# EAGLE design PowerBoard (EAGLE 9.2.2)

## Sheet 1 of 3
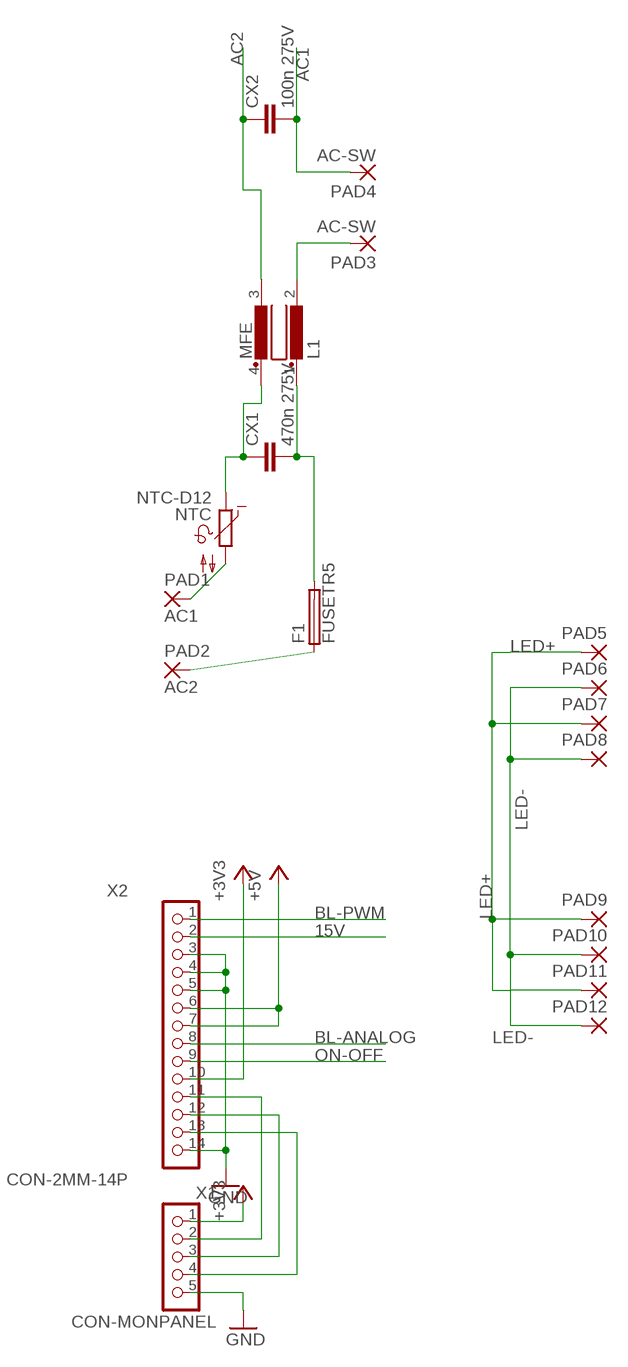
[diagram p0: schematic, sheet 1]

### Parts
CX1  470n 275V  CXXC15B10  [XC15B10]
CX2  100n 275V  CXXC15B6  [XC15B6]
F1  FUSETR5  [TR5]
L1  MFE  [MFE]
NTC  NTC-D12  [NTC-D12]
PAD1  AC1  WIREPAD3,81/1,4  [3,81/1,4]
PAD2  AC2  WIREPAD3,81/1,4  [3,81/1,4]
PAD3  AC-SW  WIREPAD2,54/1,1  [2,54/1,1]
PAD4  AC-SW  WIREPAD2,54/1,1  [2,54/1,1]
PAD5  2,54/1,1  [2,54/1,1]
PAD6  2,54/1,1  [2,54/1,1]
PAD7  2,54/1,1  [2,54/1,1]
PAD8  2,54/1,1  [2,54/1,1]
PAD9  2,54/1,1  [2,54/1,1]
PAD10  2,54/1,1  [2,54/1,1]
PAD11  2,54/1,1  [2,54/1,1]
PAD12  2,54/1,1  [2,54/1,1]
X1  CON-MONPANEL  [CON-5-PANEL]
X2  CON-2MM-14P  [CON-14-2MM]

### Nets
15V: X2.2
+3V3: X1.1 X2.10
+5V: X2.6 X2.7 ; also sheet 3
AC1: CX2.2 PAD4.1(P) ; also sheet 2,3
AC2: CX2.1 L1.3 ; also sheet 2,3
BL-ANALOG: X2.8
BL-PWM: X2.1 ; also sheet 2
GND: X1.5 X2.3 X2.4 X2.5 X2.14 ; also sheet 2,3
LED+: PAD5.1(P) PAD7.1(P) PAD9.1(P) PAD11.1(P) ; also sheet 2
LED-: PAD6.1(P) PAD8.1(P) PAD10.1(P) PAD12.1(P) ; also sheet 2
N$1: X1.2 X2.11
N$2: X1.3 X2.12
N$3: X1.4 X2.13
N$12: NTC.2 PAD1.1(P)
N$20: F1.1 PAD2.1(P)
N$35: CX1.1 L1.4 NTC.1
N$36: CX1.2 F1.2 L1.1
N$38: L1.2 PAD3.1(P)
ON-OFF: X2.9 ; also sheet 2

## Sheet 2 of 3
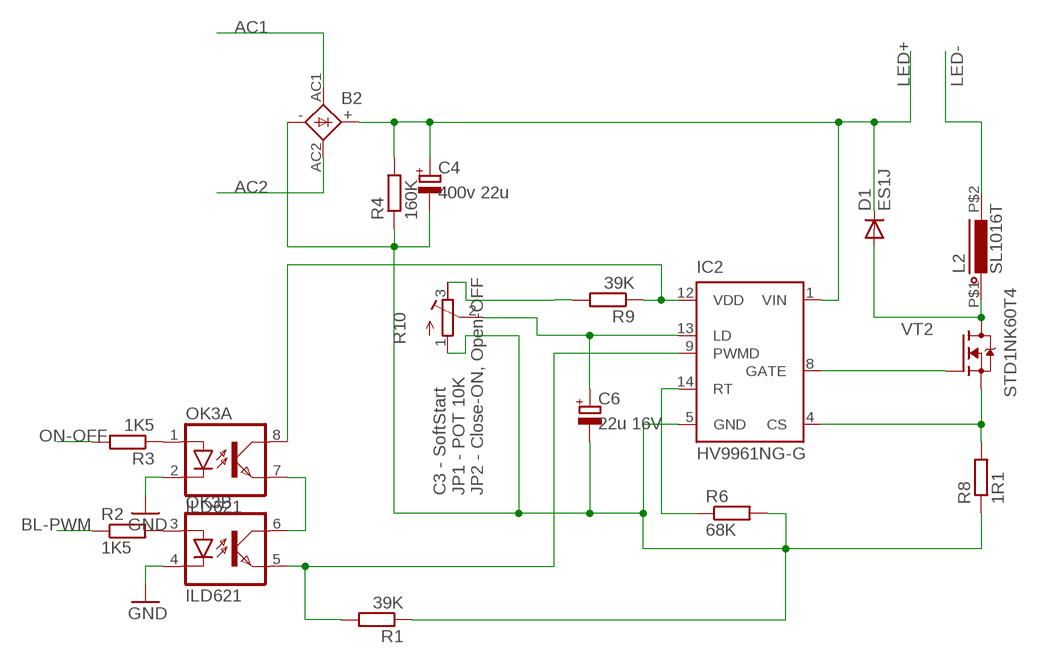
[diagram p1: schematic, sheet 2]

### Parts
B2  BRIDGEDBS  [DBS]
C4  400v 22u  CAP-POL_E3.5-8  [E3,5-8]
C6  22u 16V  CAP-POL_3528  [CT3528]
D1  ES1J  DIODE_ES1J  [DO214AC]
IC2  HV9961NG-G  HV9910BNG  [SOIC-16NG]
L2  SL1016T  INDUCTORSL1016  [SL1016]
OK3  ILD621  [DIL08]
R1  39K  R_R0805  [RESC2012X50]
R2  1K5  R_MF-025  [MF-025]
R3  1K5  R_MF-025  [MF-025]
R4  160K  R_MF-0125  [MF-0125]
R6  68K  R_R0805  [RESC2012X50]
R8  1R1  R_MF-05  [MF-05]
R9  39K  R_R0805  [RESC2012X50]
R10  R_POT3296X  [POT-3296X]
VT2  STD1NK60T4  FET-NDPAK  [DPAK]

### Nets
AC1: B2.AC1 ; also sheet 1,3
AC2: B2.AC2 ; also sheet 1,3
BL-PWM: R2.1 ; also sheet 1
GND: OK3.2(A:C) OK3.4(B:C) ; also sheet 1,3
LED+: B2.+ C4.+ D1.C IC2.1(VIN) R4.2 ; also sheet 1
LED-: L2.P$2 ; also sheet 1
N$6: OK3.6(B:COL) OK3.7(A:EMIT)
N$7: IC2.9(PWMD) OK3.5(B:EMIT) R1.2
N$8: OK3.1(A:A) R3.1
N$9: OK3.3(B:A) R2.2
N$10: IC2.14(RT) R6.1
N$11: IC2.8(GATE) VT2.G
N$18: D1.A L2.P$1 VT2.D
N$24: IC2.4(CS) R8.2 VT2.S
N$25: B2.- C4.- C6.- IC2.5(GND) R1.1 R4.1 R6.2 R8.1 R10.1(A)
N$26: C6.+ IC2.13(LD) R10.2(S)
N$27: R9.2 R10.3(E)
N$29: IC2.12(VDD) OK3.8(A:COL) R9.1
ON-OFF: R3.2 ; also sheet 1

### Notes on the sheet
- C3 - SoftStart
  JP1 - POT 10K
  JP2 - Close-ON, Open-OFF

## Sheet 3 of 3
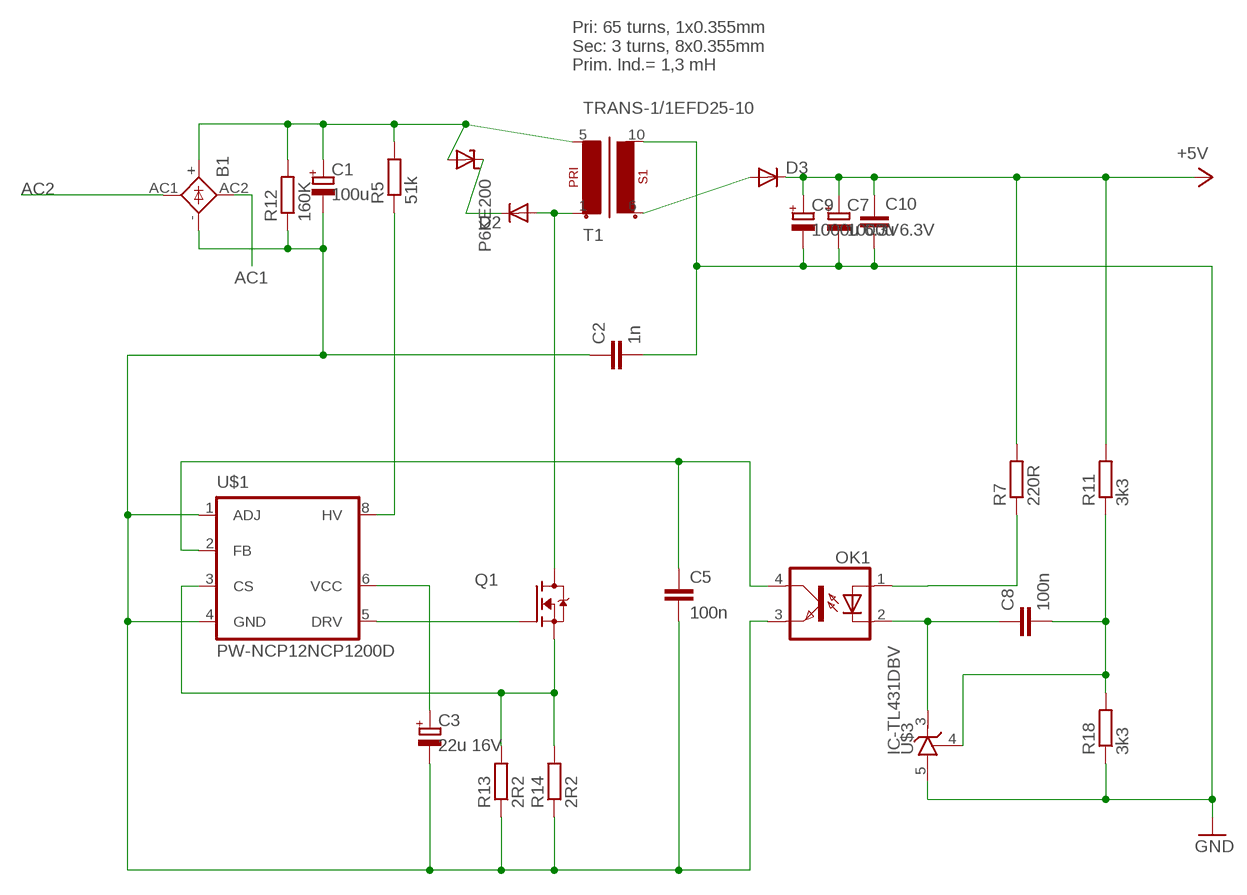
[diagram p2: schematic, sheet 3]

### Parts
B1  KBL  [KBL]
C1  100u  CAP-POL_E5-13-35-H  [E5-13-35-HORIZ]
C2  1n  CAP_C50-024X044  [C050-024X044]
C3  22u 16V  CAP-POL_E2.5-7  [E2,5-7]
C5  100n  CAP_1206  [CAP1206]
C7  1000u 6.3V  CAP-POL_E3.5-8  [E3,5-8]
C8  100n  CAP_1206  [CAP1206]
C9  1000u 6.3V  CAP-POL_E3.5-8  [E3,5-8]
C10  CAP_0805  [CAP0805]
D2  DIODE_ES1J  [DO214AC]
D3  DIODE_TO-220-2  [TO220ACS]
OK1  OPTOTRANSPC817  [DIL04]
P6KE200  SUPRESSORDO-204AC  [DO15-12]
Q1  FET-NTO-220  [TO-220V]
R5  51k  R_SQP-5  [SQP-5]
R7  220R  R_R1206  [RESC3216X60]
R11  3k3  R_R1206  [RESC3216X60]
R12  160K  R_MF-0125  [MF-0125]
R13  2R2  R_MF-025  [MF-025]
R14  2R2  R_MF-025  [MF-025]
R18  3k3  R_R1206  [RESC3216X60]
T1  TRANS-1/1EFD25-10  [EFD25_10PIN]
U$1  PW-NCP12NCP1200D  [SO8]
U$3  IC-TL431DBV  [SOT95P280X145-5]

### Nets
+5V: C7.+ C9.+ C10.1 D3.C R7.2 R11.2 ; also sheet 1
AC1: B1.AC2(AC1) ; also sheet 1,2
AC2: B1.AC1(AC2) ; also sheet 1,2
GND: C2.2 C7.- C9.- C10.2 R18.1 T1.10(S1-2) U$3.5(A) ; also sheet 1,2
N$13: B1.+ C1.+ P6KE200.A R5.2 R12.2 T1.5(P1-2)
N$14: D2.A Q1.2(D) T1.1(P1-1)
N$15: R5.1 U$1.8(HV)
N$16: C3.+ U$1.6(VCC)
N$17: C5.1 OK1.4(COL) U$1.2(FB)
N$19: D2.C P6KE200.C
N$21: OK1.1(A) R7.1
N$22: Q1.1(G) U$1.5(DRV)
N$23: C8.2 R11.1 R18.2 U$3.4(R)
N$30: B1.- C1.- C2.1 C3.- C5.2 OK1.3(EMIT) R12.1 R13.1 R14.1 U$1.1(ADJ) U$1.4(GND)
N$31: C8.1 OK1.2(C) U$3.3(C)
N$33: Q1.3(S) R13.2 R14.2 U$1.3(CS)
N$41: D3.A T1.6(S1-1)

### Notes on the sheet
- Pri: 65 turns, 1x0.355mm
  Sec: 3 turns, 8x0.355mm
  Prim. Ind.= 1,3 mH

## Library data of the parts
B1 = rectifier:KBL: DIOTEC RECTIFIER
B2 = Flamberm:BRIDGE: GENERAL INSTRUMENT RECTIFIER
C1 C7 C9 = Flamberm:CAP-POL_
C2 = Namenlos:CAP_
C3 C4 C6 = Namenlos:CAP-POL_
C5 C8 C10 = Flamberm:CAP_
CX1 CX2 = rcl:CX: X CAPACITOR for power line; SPICEPREFIX: C
D1-D3 = Flamberm:DIODE_
F1 = fuse:FUSE: Fuse; OC_FARNELL: unknown; OC_NEWARK: unknown
IC2 = Flamberm:HV9910B: Universal High Brightness LED Driver Source: www.supertex.com .. led_driver_ics_SG.pdf; OC_FARNELL: unknown; OC_NEWARK: unknown
L1 = inductors:MFE: FILTER
L2 = Namenlos:INDUCTOR
NTC = Namenlos:NTC-D12
OK1 = Namenlos:OPTOTRANS: SHARP OPTO COUPLER; MPN: PC817X4J000F; OC_FARNELL: 9707727; OC_NEWARK: 97K7059
OK3 = optocoupler:ILD621: SIEMENS OPTO COUPLER; MF: VISHAY/TELEFUNKEN; MPN: ILD621; OC_FARNELL: 1020151; OC_NEWARK: 58K1678
P6KE200 = Flamberm:SUPRESSOR
PAD1-PAD4 = wirepad:WIREPAD: Wire PAD connect wire on PCB
PAD5-PAD12 = wirepad:2,54/1,1: THROUGH-HOLE PAD
Q1 VT2 = Namenlos:FET-N
R1-R9 R11 R13 R14 R18 = Flamberm:R_
R10 = Flamberm:R_POT
R12 = Namenlos:R_
T1 = Flamberm:TRANS-1/1
U$1 = Namenlos:PW-NCP12*
U$3 = Flamberm:IC-TL431
X1 = Flamberm:CON-MONPANEL
X2 = Flamberm:CON-2MM-14P

## Board
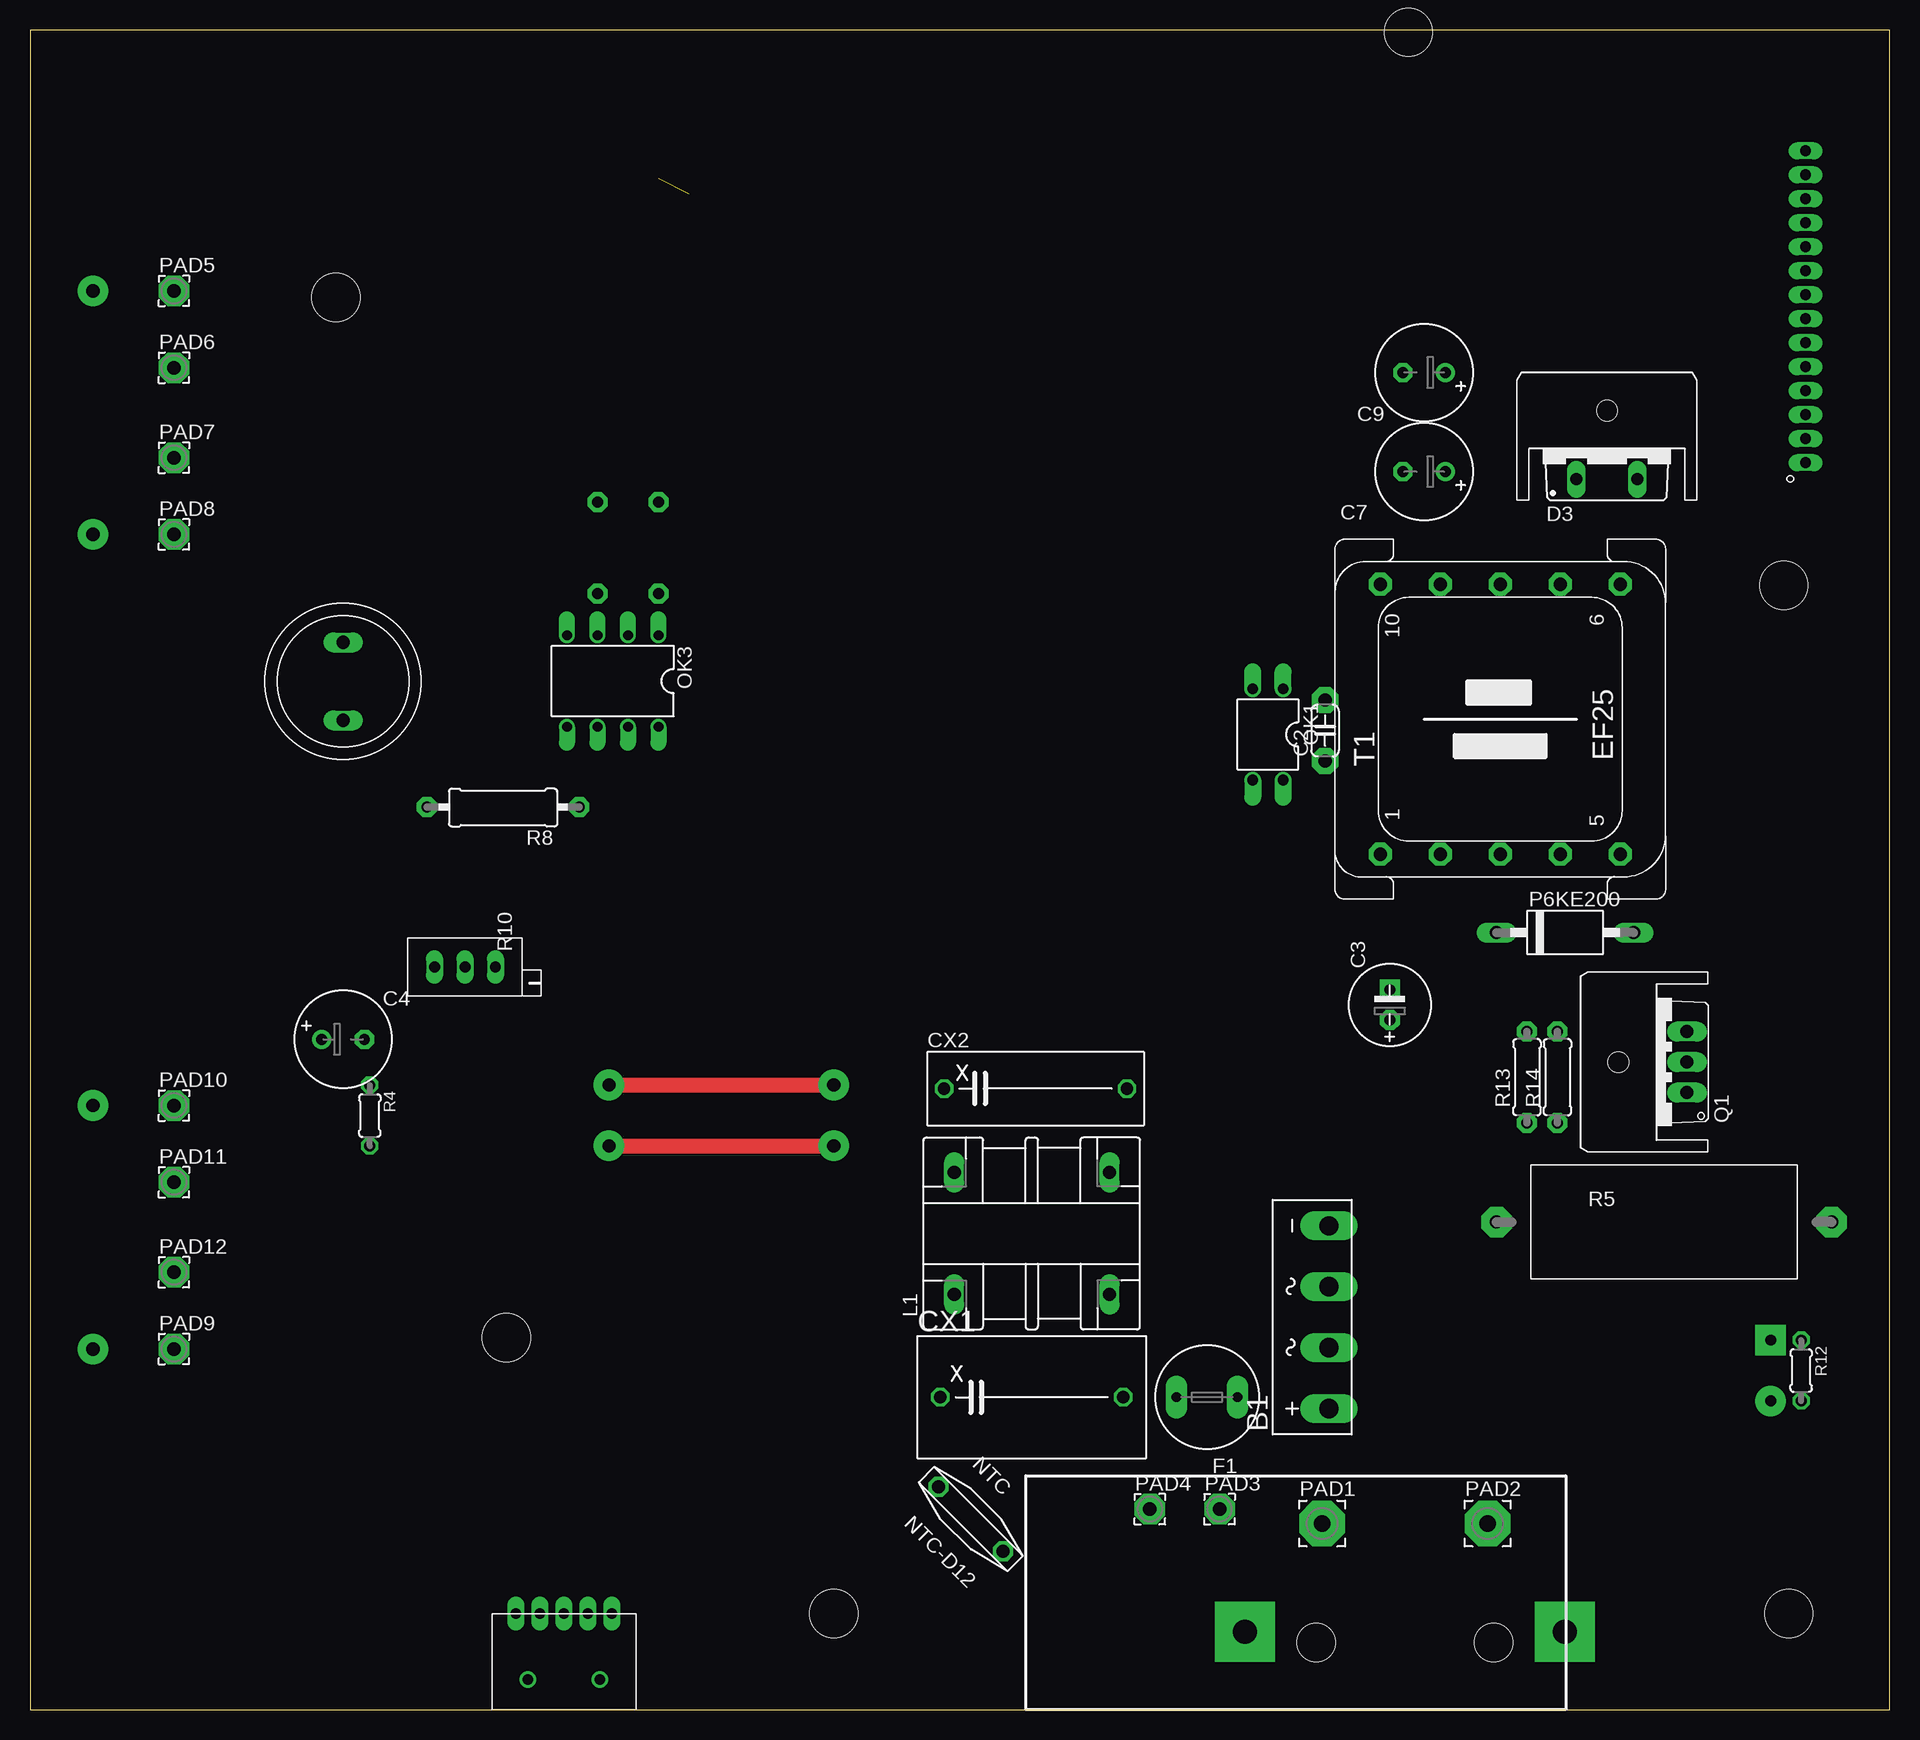
[diagram p3: board, top side]
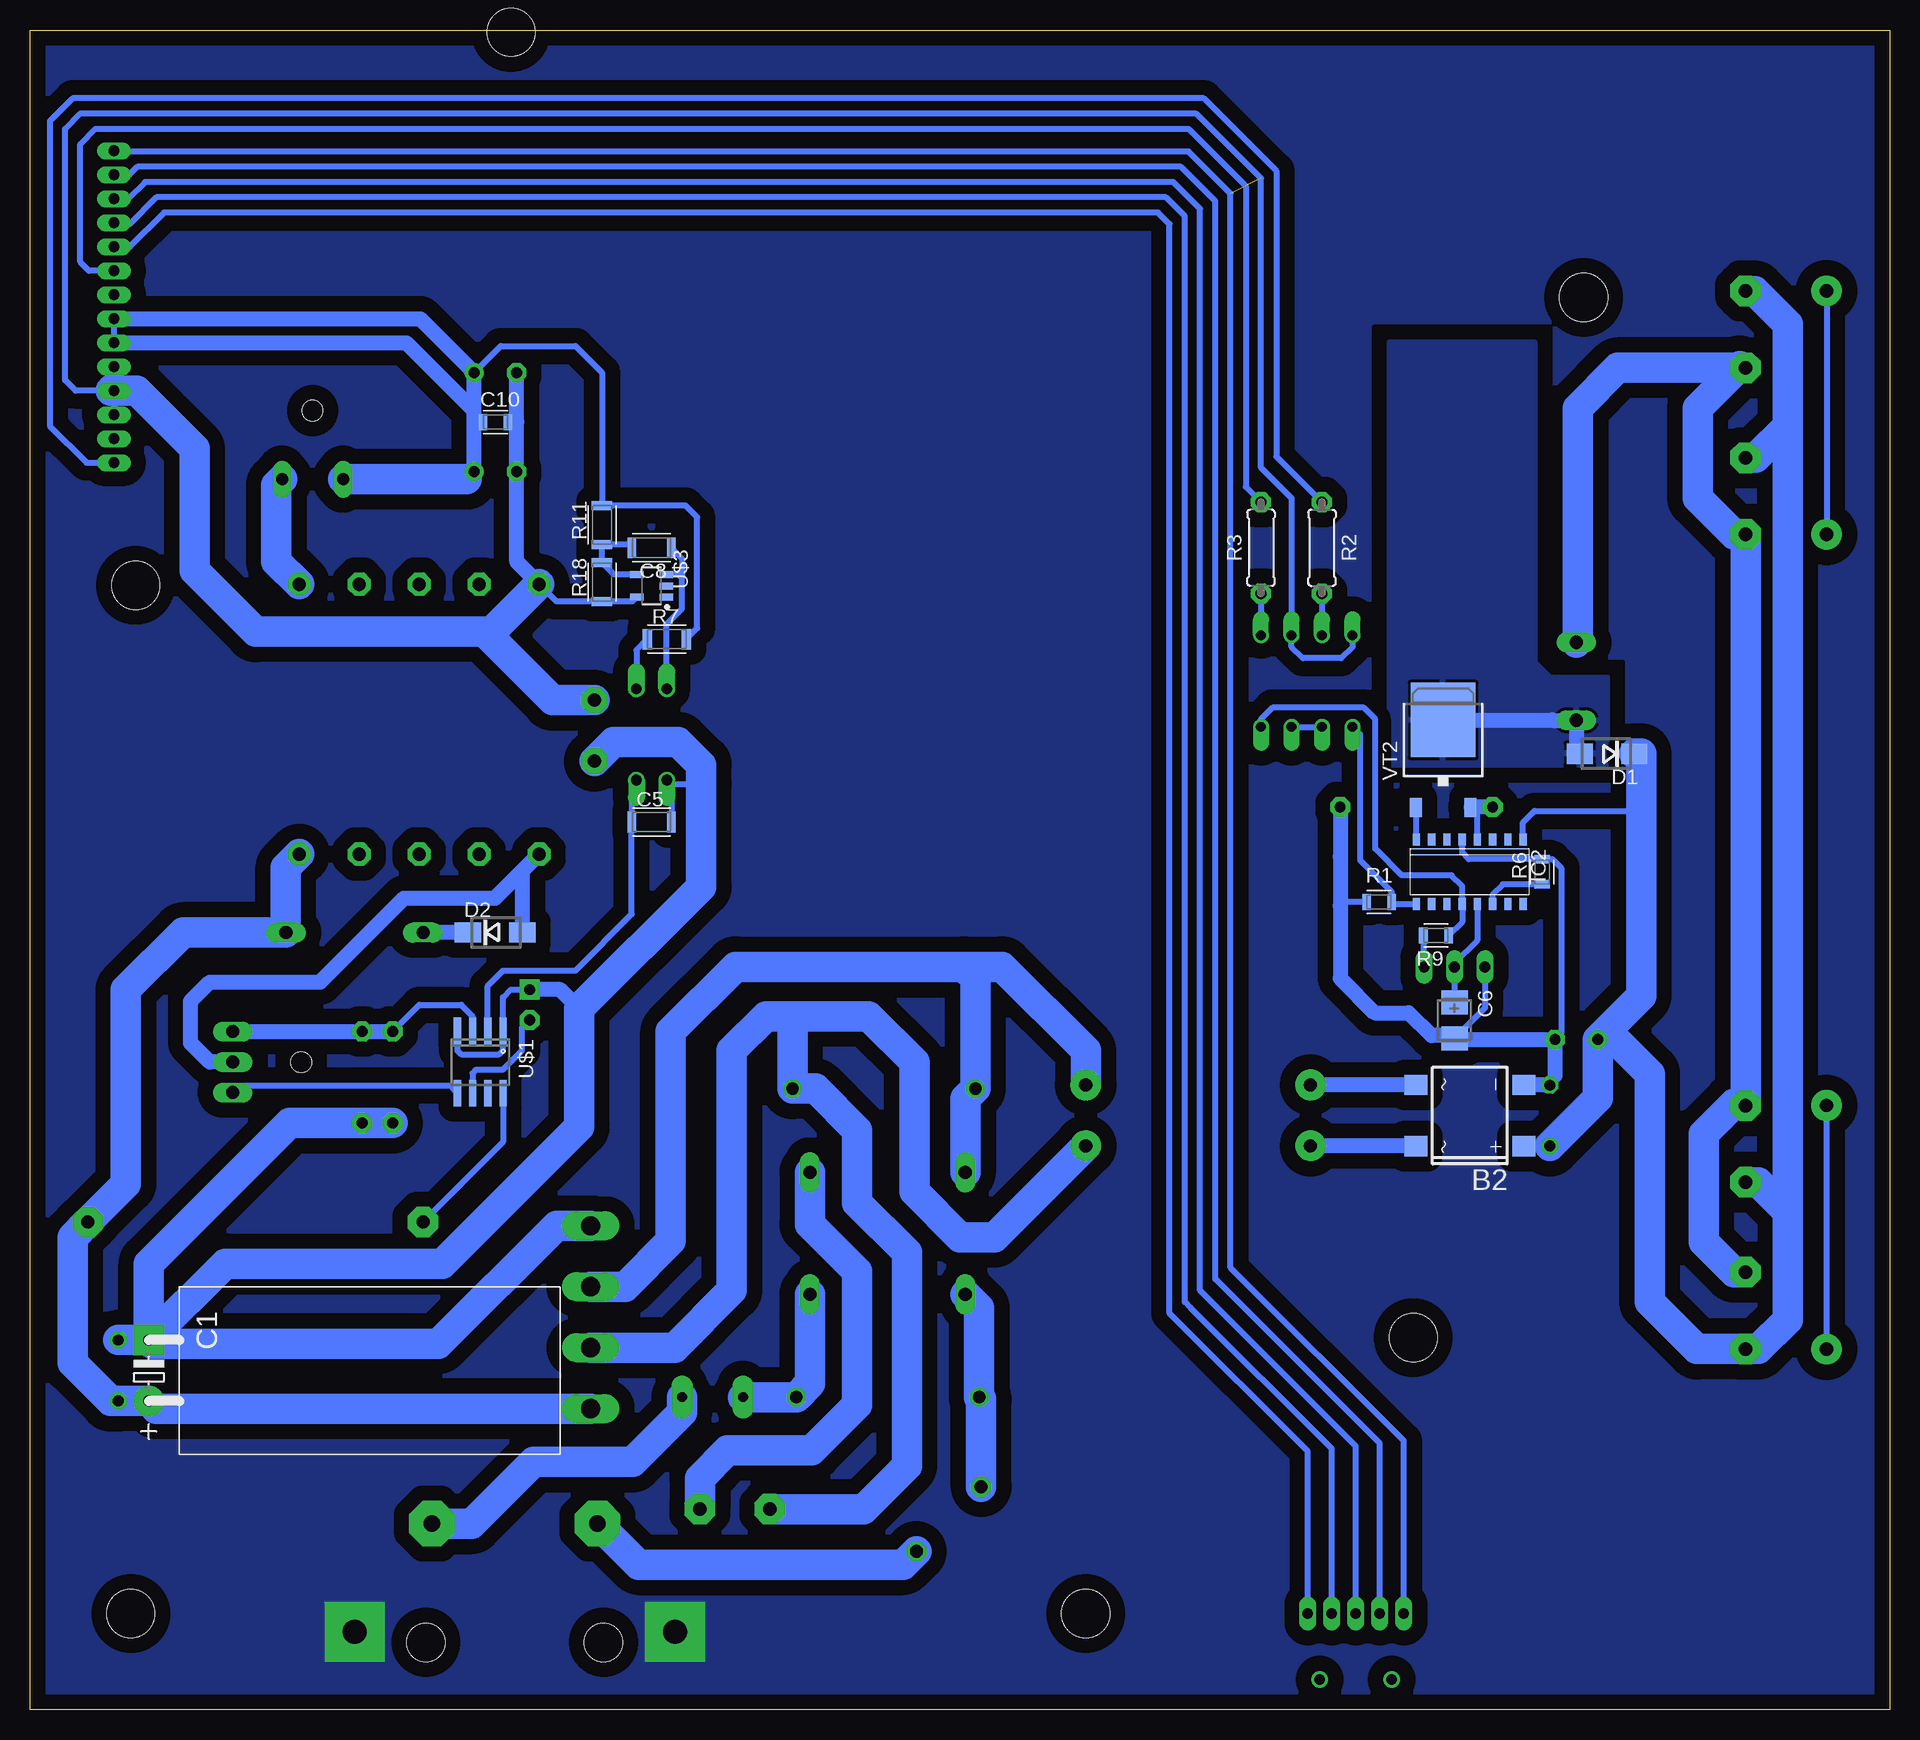
[diagram p4: board, bottom side, seen from below]

Size 155 x 140 mm. Coordinates in mm from the lower left corner, seen from the top.
Outline: 0,0 155,0 155,140 0,140 0,0
Copper layers (1*16): Top 0.035mm / dielectric 1.5mm / Bottom 0.035mm
Design rules "EagleDesignRules": minimum track width 0.25mm, minimum drill 0.3mm, track to track 0.25mm, track to pad 0.25mm, pad to pad 0.25mm, via to via 0.25mm, smd to smd 0.25mm, copper to edge 0.5mm, drill to drill 0.5mm, minimum pad ring 10mil, minimum via ring 8mil, stop-mask expansion 4mil, vias tented up to drill 0mil, thermal gap 0.25mm
Holes 4 mm at 67,8 146.6,8 114.9,139.8 25.5,117.7 39.7,31 146.2,93.7
Holes 3.2 mm at 107.2,5.6 122,5.6

### Footprints (pad centres in the part's own frame; a part is rotated, then mirrored left to right if it is on the bottom)
KBL = drill 1.6 long: + -7.62,-1.27; - 7.62,-1.27; AC1 2.54,-1.27; AC2 -2.54,-1.27
DBS = smd 1.7 x 1.9: + -2.55,-4.5; - 2.55,-4.5; AC1 -2.55,4.5; AC2 2.55,4.5
E5-13-35-HORIZ = drill 0.9 pad 2.54: + -2.54,0 | drill 0.9 pad 2.54 square: - 2.54,0
C050-024X044 = drill 1.1 pad 2.184 octagon: 1 -2.54,0; 2 2.54,0
E2,5-7 = drill 0.9 pad 1.676 octagon: + -1.27,0 | drill 0.9 pad 1.676 square: - 1.27,0
E3,5-8 = drill 0.9 pad 1.6: + -1.778,0 | drill 0.9 pad 1.6 octagon: - 1.778,0
CAP1206 = smd 0.712 x 1.712: 1 -1.65,0; 2 1.65,0
CT3528 = smd 2 x 2.2: + -1.5,0; - 1.5,0
CAP0805 = smd 0.712 x 1.312: 1 -1.05,0; 2 1.05,0
XC15B10 = drill 1.016 octagon: 1 -7.62,0; 2 7.62,0
XC15B6 = drill 1.016 octagon: 1 -7.62,0; 2 7.62,0
DO214AC = smd 2.2 x 1.7: A 2.25,0; C -2.285,0
TO220ACS = drill 1.016 long: A 2.54,-2.54; C -2.54,-2.54
TR5 = drill 0.813 pad 1.778 long: 1 -2.54,0; 2 2.54,0
SOIC-16NG = smd 0.6 x 1: 1 -4.445,-2.675; 2 -3.175,-2.675; 3 -1.905,-2.675; 4 -0.635,-2.675; 5 0.635,-2.675; 6 1.905,-2.675; 7 3.175,-2.675; 8 4.445,-2.675; 9 4.445,2.675; 10 3.175,2.675; 11 1.905,2.675; 12 0.635,2.675; 13 -0.635,2.675; 14 -1.905,2.675; 15 -3.175,2.675; 16 -4.445,2.675
MFE = drill 1.118 long: 1 6.477,-5.08; 2 6.477,5.08; 3 -6.477,5.08; 4 -6.477,-5.08
SL1016 = drill 1.1 long: P$1 3.25,0; P$2 -3.25,0
NTC-D12 = drill 1.1 pad 1.676 octagon: 1 -3.81,0; 2 3.81,0
DIL04 = drill 0.9 pad 1.27 offset: 1 -1.27,-3.81; 2 1.27,-3.81; 3 1.27,3.81; 4 -1.27,3.81
DIL08 = drill 0.813 offset: 1 -3.81,-3.81; 2 -1.27,-3.81; 3 1.27,-3.81; 4 3.81,-3.81; 5 3.81,3.81; 6 1.27,3.81; 7 -1.27,3.81; 8 -3.81,3.81
DO15-12 = drill 1.1 pad 1.676 long: A 5.08,0; C -6.35,0
3,81/1,4 = drill 1.397 pad 3.81 octagon: 1 0,0
2,54/1,1 = drill 1.118 pad 2.54 octagon: 1 0,0
TO-220V = drill 1.1 long: 1 -2.54,-2.54; 2 0,-2.54; 3 2.54,-2.54
RESC2012X50 = smd 0.712 x 1.312: 1 -1.05,0; 2 1.05,0
MF-025 = drill 0.9 pad 1.676 octagon: 1 -3.81,0; 2 3.81,0
MF-0125 = drill 0.9 octagon: 1 -2.54,0; 2 2.54,0
SQP-5 = drill 1.1 pad 2.54 octagon: 1 -13.97,0; 2 13.97,0
RESC3216X60 = smd 0.762 x 1.712: 1 -1.625,0; 2 1.625,0
MF-05 = drill 0.9 pad 1.676 octagon: 1 -6.35,0; 2 6.35,0
POT-3296X = drill 0.9 long: 1 0,-2.54; 2 0,0; 3 0,2.54
EFD25_10PIN = drill 1.1 pad 1.93 octagon: 1 -11.25,10; 2 -11.25,5; 3 -11.25,0; 4 -11.25,-5; 5 -11.25,-10; 6 11.25,-10; 7 11.25,-5; 8 11.25,0; 9 11.25,5; 10 11.25,10
SO8 = smd 0.6 x 2.2: 1 -1.905,-2.6; 2 -0.635,-2.6; 3 0.635,-2.6; 4 1.905,-2.6; 5 1.905,2.6; 6 0.635,2.6; 7 -0.635,2.6; 8 -1.905,2.6
SK95-3M3_HOLE = hole 1.7: 0,3.175
SOT95P280X145-5 = smd 1.127 x 0.589: 1 -1.242,0.95; 2 -1.242,0; 3 -1.242,-0.95; 4 1.242,-0.95; 5 1.242,0.95
DPAK = smd 5.4 x 6.2: D 0,2.5 | smd 1 x 1.6: G -2.28,-4.8; S 2.28,-4.8
CON-5-PANEL = drill 0.9 long: 1 4,0; 2 2,0; 3 0,0; 4 -2,0; 5 -4,0 | drill 0.9: P$6 3,-5.5; P$7 -3,-5.5
CON-14-2MM = drill 0.9 long: 1 -13,0; 2 -11,0; 3 -9,0; 4 -7,0; 5 -5,0; 6 -3,0; 7 -1,0; 8 1,0; 9 3,0; 10 5,0; 11 7,0; 12 9,0; 13 11,0; 14 13,0

### Placement (x,y rotation side)
B1  107,32.7 90 top
B2  34.99,49.51 90 bottom
C1  145.1,28.26 90 bottom
C2  107.95,81.6 90 top
C3  113.35,58.74 90 top
C4  26.1,55.86 0 top
C5  103.19,73.98 0 bottom
C6  36.26,57.45 270 bottom
C7  116.2,103.19 180 top
C8  103.19,96.84 180 bottom
C9  116.2,111.44 180 top
C10  116.2,107.31 0 bottom
CX1  83.5,26.04 0 top
CX2  83.82,51.75 0 top
D1  23.56,79.67 180 bottom
D2  116.2,64.77 0 bottom
D3  131.44,105.09 0 top
F1  98.11,26.04 180 top
IC2  34.99,69.83 180 bottom
L1  83.5,39.69 0 top
L2  26.1,85.7 270 top
NTC  78.42,15.88 315 top
OK1  103.19,81.28 180 top
OK3  48.58,85.72 180 top
P6KE200  128.59,64.77 0 top
PAD1  107.7,15.5 0 top
PAD2  121.5,15.5 0 top
PAD3  99.15,16.7 0 top
PAD4  93.35,16.7 0 top
PAD5  12,118.25 0 top
PAD6  12,111.85 0 top
PAD7  12,104.35 0 top
PAD8  12,97.95 0 top
PAD9  12,30.05 0 top
PAD10  12,50.35 0 top
PAD11  12,43.95 0 top
PAD12  12,36.45 0 top
Q1  135.57,53.98 90 top
R1  42.55,67.31 0 bottom
R2  47.31,96.84 270 bottom
R3  52.39,96.84 90 bottom
R4  28.32,49.51 270 top
R5  136.21,40.64 0 top
R6  28.96,69.83 90 bottom
R7  101.92,89.22 0 bottom
R8  39.44,75.23 180 top
R9  37.8,64.52 180 bottom
R10  36.26,61.89 270 top
R11  107.31,98.74 90 bottom
R12  147.64,28.26 270 top
R13  124.78,52.7 90 top
R14  127.32,52.7 90 top
R18  107.31,93.98 90 bottom
T1  122.56,82.55 90 top
U$1  117.47,53.98 180 bottom
U$2  [SK95-3M3_HOLE]  135.57,53.98 90 top
U$3  103.19,93.66 180 bottom
U$4  [SK95-3M3_HOLE]  131.44,105.09 0 top
VT2  37.21,79.99 0 bottom
X1  44.5,8 0 top
X2  148,116.93 90 top

### Tracks (layer width: path | path; a pad name or v marks a point on that pad's centre or on a via)
+3V3
  Bottom 0.508: X1.1 48.5,21.51 60.01,33.02 60.01,123.83 60.96,124.78 103.82,124.78 143.83,124.78 146.69,121.92 X2.10
+5V
  Bottom 0.508: X2.6 X2.7 | C10.1 117.98,107.31 | C9.+ 115.76,113.67 109.54,113.67 107.31,111.44 R11.2 100.37,100.37 99.38,99.38 99.38,90.13 R7.2
  Bottom 1.27: 118.62,102.55 C7.+ 117.98,107.31 117.98,108.27 | 117.98,108.27 C9.+ 122.47,115.93 X2.7 | X2.6 123.64,113.93 117.98,108.27
  Bottom 2.54: D3.C 118.62,102.55
AC1  (via drill 1.1 pad 2.56)
  Top 1.27: v48.26,46.99 v66.99,46.99
  Bottom 1.27: B2.AC1 48.23,46.96 v48.26,46.99
  Bottom 2.54: 91.44,57.78 85.09,57.78 81.28,53.98 81.28,43.18 77.47,39.37 74.61,39.37 v66.99,46.99 | 91.44,57.78 93.66,57.78 96.52,54.93 96.52,34.92 101.28,30.16 B1.AC2 | PAD4.1 85.53,16.7 81.92,20.32 81.92,38.1 86.04,42.23 86.04,48.26 89.53,51.75 CX2.2 91.44,57.78
AC2  (via drill 1.1 pad 2.56)
  Top 1.27: v48.26,52.07 v66.99,52.07
  Bottom 1.27: B2.AC2 v48.25,52.06 v48.26,52.07
  Bottom 2.54: B1.AC1 105.41,35.24 101.6,39.05 101.6,56.52 96.2,61.91 77.15,61.91 | 77.15,61.91 73.98,61.91 66.99,54.93 v66.99,52.07 | L1.3 77.03,50.93 CX2.1 76.2,60.96 77.15,61.91
BL-PWM
  Bottom 0.508: X2.1 150.28,103.93 153.35,107 153.35,132.4 151.45,134.3 57.15,134.3 51.12,128.27 51.12,104.46 R2.1
GND  (1 unrouted)
  Bottom 0.508: X1.5 40.5,22.4 54.93,36.83 54.93,126.36 58.42,129.86 147.93,129.86 X2.14 | X2.5 148,110.2 | X2.3 X2.4 148.27,109.93 151.2,109.93 152.08,110.81 152.08,131.76 150.84,133.01 57.76,133.01 52.39,127.64 52.39,103.5 49.85,100.97 OK3.2 49.85,88.58 48.9,87.63 45.72,87.63 44.77,88.58 OK3.4 | C10.2 114.43,107.31 | T1.10 111.11,92.36 107.63,92.36 R18.1 104.79,92.36 U$3.5
  Bottom 1.27: 116.5,89.85 117.16,89.85 | 144.12,107.93 143.83,107.63 | T1.10 114.43,95.67 C7.- 114.43,107.31 C9.-
  Bottom 2.54: 148,110.2 148.27,109.93 | T1.10 116.5,89.85 | X2.4 146.12,109.93 144.12,107.93 | 143.83,107.63 141.29,105.09 141.29,94.93 136.21,89.85 117.16,89.85 111.44,84.14 C2.2
GROUND  (via drill 2 pad 5)
  other vias: 101.25,6.5 127.95,6.5
  pour Bottom (isolate 1.27, rank 6): 0,0.32 154.94,0.32 154.94,139.7 0,139.7
LED+
  Bottom 0.508: R4.2 B2.+ | IC2.1 30.55,73.96 29.59,74.91 20.7,74.91
  Bottom 2.54: C4.+ 24.32,50.97 R4.2 | C4.+ 20.7,59.48 20.7,74.91 20.7,79.67 D1.C | PAD5.1 11.25,118.25 8.5,115.5 8.5,107 | PAD7.1 11.15,104.35 8.5,107 | PAD11.1 10.95,43.95 8.5,41.5 | 8.5,41.5 8.5,32.5 10.95,30.05 PAD9.1 16.05,30.05 20,34 20,53 22.86,55.86 C4.+ | 8.5,41.5 8.5,107
LED-
  Bottom 1.27: 12.5,112 12.35,111.85 | 13,50.5 12.85,50.35
  Bottom 2.54: 12.5,112 16,108.5 16,101 12.95,97.95 PAD8.1 12,89.5 PAD10.1 12.85,50.35 | 12.35,111.85 PAD6.1 22.65,111.85 26,108.5 26,89.06 L2.P$2 | PAD12.1 12.95,36.45 15.5,39 15.5,48 13,50.5
N$1
  Bottom 0.508: X1.2 46.5,21.73 58.26,33.5 58.74,33.97 58.74,124.46 60.33,126.05 144.46,126.05 146.69,123.83 147.9,123.83 X2.11
N$2
  Bottom 0.508: X1.3 44.5,21.96 57.47,34.92 57.47,125.09 59.69,127.32 145.41,127.32 146.81,125.93 X2.12
N$3
  Bottom 0.508: X1.4 42.5,22.18 56.2,35.88 56.2,125.73 59.05,128.59 146.05,128.59 146.71,127.93 X2.13
N$4  (via drill 1.1 pad 2.56)
  Bottom 0.508: v5.25,118.25 v5.25,97.95
N$5  (via drill 1.1 pad 2.56)
  Bottom 0.508: v5.25,30.05 v5.25,50.35
N$6
  Bottom 0.508: OK3.7 OK3.6
N$7
  Bottom 0.508: IC2.9 41.34,67.16 R1.2 41.49,68.17 44.13,70.8 44.13,81.28 OK3.5
N$8
  Bottom 0.508: R3.1 OK3.1
N$9
  Bottom 0.508: R2.2 OK3.3
N$10
  Bottom 0.508: R6.1 32.23,68.78 33.09,67.92 IC2.14
N$11
  Bottom 0.508: IC2.8 39.44,75.13 VT2.G
N$12
  Bottom 2.54: PAD1.1 104.27,12.06 82.23,12.06 NTC.2
N$13
  Bottom 1.27: 144.46,25.08 C1.+
  Bottom 2.54: C1.+ R12.2 148.27,25.72 151.45,28.89 151.45,39.37 R5.2 147,43.81 147,60.01 142.24,64.77 P6KE200.A 133.67,70.19 T1.5 | B1.+ 144.46,25.08
N$14
  Bottom 1.27: D2.A 113.95,69.9 T1.1 116.23,67.63 123.83,67.63 130.81,60.64 140.02,60.64 141.6,59.05 141.6,55.56 140.02,53.98 Q1.2
N$15
  Bottom 0.508: U$1.8 115.57,47.31 R5.1
N$16
  Bottom 0.508: C3.+ 113.98,56.83 113.98,54.93 115.57,53.34 117.79,53.34 118.11,53.02 U$1.6
N$17
  Bottom 0.508: U$1.2 116.84,60.33 115.57,61.59 109.54,61.59 104.84,66.3 104.84,73.66 C5.1 104.84,77.09 OK1.4
N$18
  Bottom 1.27: D1.A 26.1,79.96 L2.P$1 28.08,82.45 28.11,82.49 VT2.D
  pour Bottom (isolate 1.016): 23.56,78.72 41.66,78.72 41.66,113.96 29.59,113.96 29.59,87.29 28.32,86.02 23.56,86.02
N$19
  Bottom 1.27: D2.C P6KE200.C
N$20
  Bottom 2.54: PAD2.1 118.17,15.5 113.03,20.64 104.78,20.64 100.65,24.77 F1.1
N$21
  Bottom 0.508: R7.1 104.46,88.3 OK1.1
N$22
  Bottom 0.508: U$1.5 120.02,52.01 137.54,52.01 Q1.1
N$23
  Bottom 0.508: C8.2 105.12,97.12 R11.1 R18.2 106.32,94.61 U$3.4
N$24
  Bottom 0.406: 34.9,75.23 VT2.S
  Bottom 0.508: IC2.4 34.35,74.61 VT2.S
  Bottom 1.27: R8.2 34.9,75.23
N$25
  Bottom 0.508: R4.1 28.49,52.22 | 27.88,52.83 28.49,52.22 | 28.49,52.22 28.65,52.06 | C6.- 33.72,58.49 33.72,62.21 R10.1 | IC2.5 35.62,71.42 35.09,70.88 R6.2 28.1,70.88 27.37,70.15 27.37,56.37 C4.- | C6.- 36.49,56.18 | C6.- 36.17,55.86 | R1.1 45.47,67.31 45.78,66.99
  Bottom 1.27: R8.1 45.78,71.1 45.78,66.99 45.78,60.94 42.93,58.08 40.07,58.08 38.16,56.18 36.49,56.18 | 28.65,52.06 B2.- | 27.88,52.83 C4.- 36.17,55.86
N$26
  Bottom 0.508: 36.26,61.58 36.26,62.21 34.35,64.11 IC2.13 | 36.26,61.58 C6.+ | R10.2 36.26,61.58
N$27
  Bottom 0.508: R9.2 38.85,61.95 R10.3
N$29
  Bottom 0.508: R9.1 35.62,65.64 IC2.12 35.62,68.64 36.51,69.53 40.64,69.53 42.86,71.75 42.86,82.55 43.81,83.5 51.44,83.5 52.39,82.55 OK3.8
N$30
  Bottom 0.508: C3.- 114.94,60.01 115.57,59.37 U$1.1 115.57,54.93 115.89,54.61 119.06,54.61 119.38,54.93 U$1.4 | C5.2 101.54,77.09 OK1.3 101.6,77.15 99.38,77.15 99.06,77.15
  Bottom 1.27: 144.78,30.48 C1.- | 109.22,58.42 110.81,60.01 C3.-
  Bottom 2.54: R13.1 R14.1 133.35,48.9 145.1,37.15 C1.- | C1.- R12.1 | B1.- 111.12,40.32 120.97,30.48 144.78,30.48 | C1.- 138.75,37.15 120.65,37.15 109.22,48.58 109.22,58.42 99.06,68.58 99.06,77.15 99.06,78.74 100.97,80.64 106.36,80.64 C2.1
N$31
  Bottom 0.508: OK1.2 101.92,90.49 100.65,91.76 100.65,94.3 | 100.65,94.3 100.97,94.61 U$3.3 | C8.1 100.65,95.95 100.65,94.3
N$33
  Bottom 0.508: R13.2 122.56,58.74 119.06,58.74 118.11,57.78 U$1.3
  Bottom 1.27: R13.2 R14.2 Q1.3
N$35
  Bottom 2.54: L1.4 75.88,33.47 CX1.1 75.73,25.88 NTC.1
N$36
  Bottom 2.54: F1.2 CX1.2 89.98,27.18 L1.1
N$38
  Bottom 2.54: PAD3.1 99.15,19.28 96.84,21.59 89.85,21.59 86.04,25.4 86.04,36.51 89.98,40.45 L1.2
N$41
  Bottom 2.54: T1.6 134.46,95.7 134.46,102.08 D3.A
ON-OFF
  Bottom 0.508: X2.9 150.09,119.93 150.81,120.65 150.81,130.49 149.54,131.76 58.42,131.76 53.66,127 53.66,101.92 R3.2